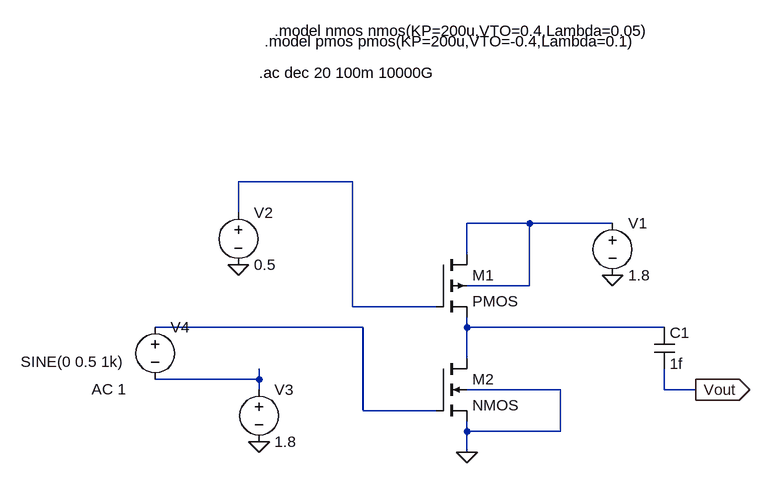
[diagram p0: schematic Exp-8 common source with current load.asc]
Exp-8 common source with current load.asc, the LTspice schematic file:
Version 4
SHEET 1 880 680
WIRE -80 -144 -256 -144
WIRE -256 -96 -256 -144
WIRE 192 -80 96 -80
WIRE 320 -80 192 -80
WIRE 96 -32 96 -80
WIRE 192 16 192 -80
WIRE 192 16 96 16
WIRE -80 48 -80 -144
WIRE 48 48 -80 48
WIRE -64 80 -384 80
WIRE 96 80 96 64
WIRE 400 80 96 80
WIRE 96 128 96 80
WIRE -224 160 -224 144
WIRE -224 160 -384 160
WIRE -224 176 -224 160
WIRE 240 176 96 176
WIRE 400 176 400 144
WIRE 448 176 400 176
WIRE -64 208 -64 80
WIRE 48 208 -64 208
WIRE 96 240 96 224
WIRE 240 240 240 176
WIRE 240 240 96 240
WIRE 96 272 96 240
FLAG 96 272 0
FLAG -256 -16 0
FLAG 320 0 0
FLAG -224 256 0
FLAG 448 176 Vout
IOPIN 448 176 Out
SYMBOL pmos4 48 -32 R0
SYMATTR InstName M1
SYMATTR Value2 l=180n w=800n
SYMBOL nmos4 48 128 R0
SYMATTR InstName M2
SYMATTR Value2 l=180n w=400n
SYMBOL voltage 320 -96 R0
WINDOW 123 0 0 Left 0
WINDOW 39 0 0 Left 0
SYMATTR InstName V1
SYMATTR Value 1.8
SYMBOL voltage -256 -112 R0
WINDOW 123 0 0 Left 0
WINDOW 39 0 0 Left 0
SYMATTR InstName V2
SYMATTR Value 0.5
SYMBOL voltage -224 160 R0
WINDOW 123 0 0 Left 0
WINDOW 39 0 0 Left 0
SYMATTR InstName V3
SYMATTR Value 1.8
SYMBOL voltage -384 64 R0
WINDOW 3 -207 69 Left 2
WINDOW 123 -98 111 Left 2
WINDOW 39 0 0 Left 0
SYMATTR InstName V4
SYMATTR Value SINE(0 0.5 1k)
SYMATTR Value2 AC 1
SYMBOL cap 384 80 R0
SYMATTR InstName C1
SYMATTR Value 1f
TEXT -216 -360 Left 2 !.model pmos pmos(KP=200u,VTO=-0.4,Lambda=0.1)
TEXT -224 -312 Left 2 !.ac dec 20 100m 10000G
TEXT -200 -376 Left 2 !.model nmos nmos(KP=200u,VTO=0.4,Lambda=0.05)

The netlist it stands for:
* Exp-8 common source with current load.asc
M1 N002 N001 N004 N002 PMOS l=180n w=800n
M2 N004 N003 0 0 NMOS l=180n w=400n
V1 N002 0 1.8
V2 N001 0 0.5
V3 N005 0 1.8
V4 N003 N005 SINE(0 0.5 1k) AC 1
C1 N004 Vout 1f
.model NMOS NMOS
.model PMOS PMOS
.lib standard.mos
.model pmos pmos(KP=200u,VTO=-0.4,Lambda=0.1)
.ac dec 20 100m 10000G
.model nmos nmos(KP=200u,VTO=0.4,Lambda=0.05)
.backanno
.end